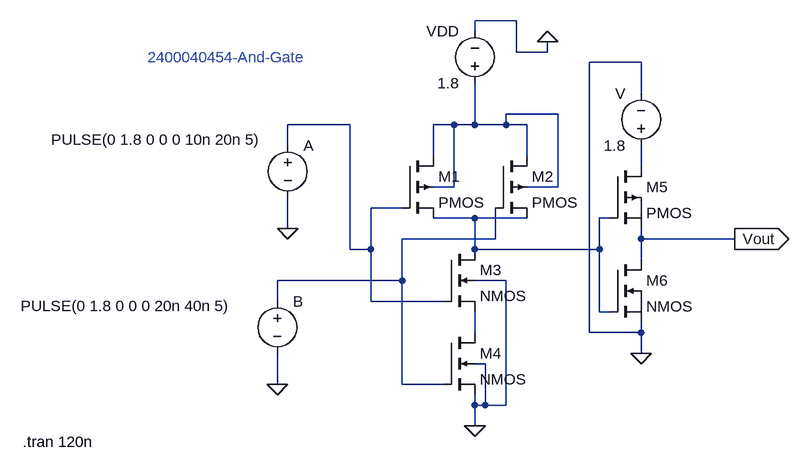
[diagram p0: schematic And-Schematic.asc]
And-Schematic.asc, the LTspice schematic file:
Version 4.1
SHEET 1 880 680
WIRE 240 -176 176 -176
WIRE 176 -160 176 -176
WIRE 240 -128 240 -176
WIRE 288 -128 288 -144
WIRE 288 -128 240 -128
WIRE 432 -112 352 -112
WIRE 432 -64 432 -112
WIRE 304 -32 224 -32
WIRE -16 -16 -112 -16
WIRE 144 -16 112 -16
WIRE 176 -16 176 -80
WIRE 176 -16 144 -16
WIRE 224 -16 224 -32
WIRE 224 -16 176 -16
WIRE 256 -16 224 -16
WIRE -112 16 -112 -16
WIRE 112 32 112 -16
WIRE 256 32 256 -16
WIRE 432 48 432 16
WIRE 144 80 144 -16
WIRE 144 80 112 80
WIRE 304 80 304 -32
WIRE 304 80 256 80
WIRE 64 112 16 112
WIRE 176 128 112 128
WIRE 256 128 176 128
WIRE 384 128 368 128
WIRE -112 144 -112 96
WIRE 208 160 208 112
WIRE 208 160 64 160
WIRE 432 160 432 144
WIRE 576 160 432 160
WIRE -16 176 -16 -16
WIRE 16 176 16 112
WIRE 16 176 -16 176
WIRE 176 176 176 128
WIRE 368 176 368 128
WIRE 368 176 176 176
WIRE 432 192 432 160
WIRE 64 224 64 160
WIRE 64 224 -128 224
WIRE 224 224 176 224
WIRE -128 256 -128 224
WIRE 16 256 16 176
WIRE 128 256 16 256
WIRE 368 272 368 176
WIRE 384 272 368 272
WIRE 176 304 176 272
WIRE 352 304 352 -112
WIRE 432 304 432 288
WIRE 432 304 352 304
WIRE 432 336 432 304
WIRE 192 352 176 352
WIRE -128 384 -128 336
WIRE 64 384 64 224
WIRE 128 384 64 384
WIRE 176 416 176 400
WIRE 192 416 192 352
WIRE 192 416 176 416
WIRE 224 416 224 224
WIRE 224 416 192 416
WIRE 176 448 176 416
FLAG 176 448 0
FLAG 288 -144 0
FLAG -112 144 0
FLAG -128 384 0
FLAG 432 336 0
FLAG 576 160 Vout
IOPIN 576 160 Out
SYMBOL pmos4 64 32 R0
SYMATTR InstName M1
SYMBOL pmos4 208 32 R0
SYMATTR InstName M2
SYMBOL nmos4 128 176 R0
SYMATTR InstName M3
SYMBOL nmos4 128 304 R0
SYMATTR InstName M4
SYMBOL voltage 176 -64 R180
WINDOW 0 24 96 Left 2
WINDOW 3 24 16 Left 2
SYMATTR InstName VDD
SYMATTR Value 1.8
SYMBOL voltage -112 0 R0
WINDOW 3 -364 7 Left 2
WINDOW 123 0 0 Left 0
WINDOW 39 0 0 Left 0
SYMATTR InstName A
SYMATTR Value PULSE(0 1.8 0 0 0 10n 20n 5)
SYMBOL voltage -128 240 R0
WINDOW 3 -395 23 Left 2
WINDOW 123 0 0 Left 0
WINDOW 39 0 0 Left 0
SYMATTR InstName B
SYMATTR Value PULSE(0 1.8 0 0 0 20n 40n 5)
SYMBOL pmos 384 48 R0
SYMATTR InstName M5
SYMBOL nmos 384 192 R0
SYMATTR InstName M6
SYMBOL voltage 432 32 R180
WINDOW 0 24 96 Left 2
WINDOW 3 24 16 Left 2
SYMATTR InstName V
SYMATTR Value 1.8
TEXT -520 472 Left 2 !.tran 120n
TEXT -328 -120 Left 2 ;2400040454-And-Gate

The netlist it stands for:
* And-Schematic.asc
M1 N001 N002 N004 N001 PMOS
M2 N001 N005 N004 N001 PMOS
M3 N004 N002 N006 0 NMOS
M4 N006 N005 0 0 NMOS
VDD N001 0 1.8
V§A N002 0 PULSE(0 1.8 0 0 0 10n 20n 5)
V§B N005 0 PULSE(0 1.8 0 0 0 20n 40n 5)
M5 N003 N004 Vout Vout PMOS
M6 Vout N004 0 0 NMOS
V N003 0 1.8
.model NMOS NMOS
.model PMOS PMOS
.lib standard.mos
.tran 120n
* 2400040454-And-Gate
.backanno
.end